# Altium project SX1308_GTW_e381v02c.PrjPCB
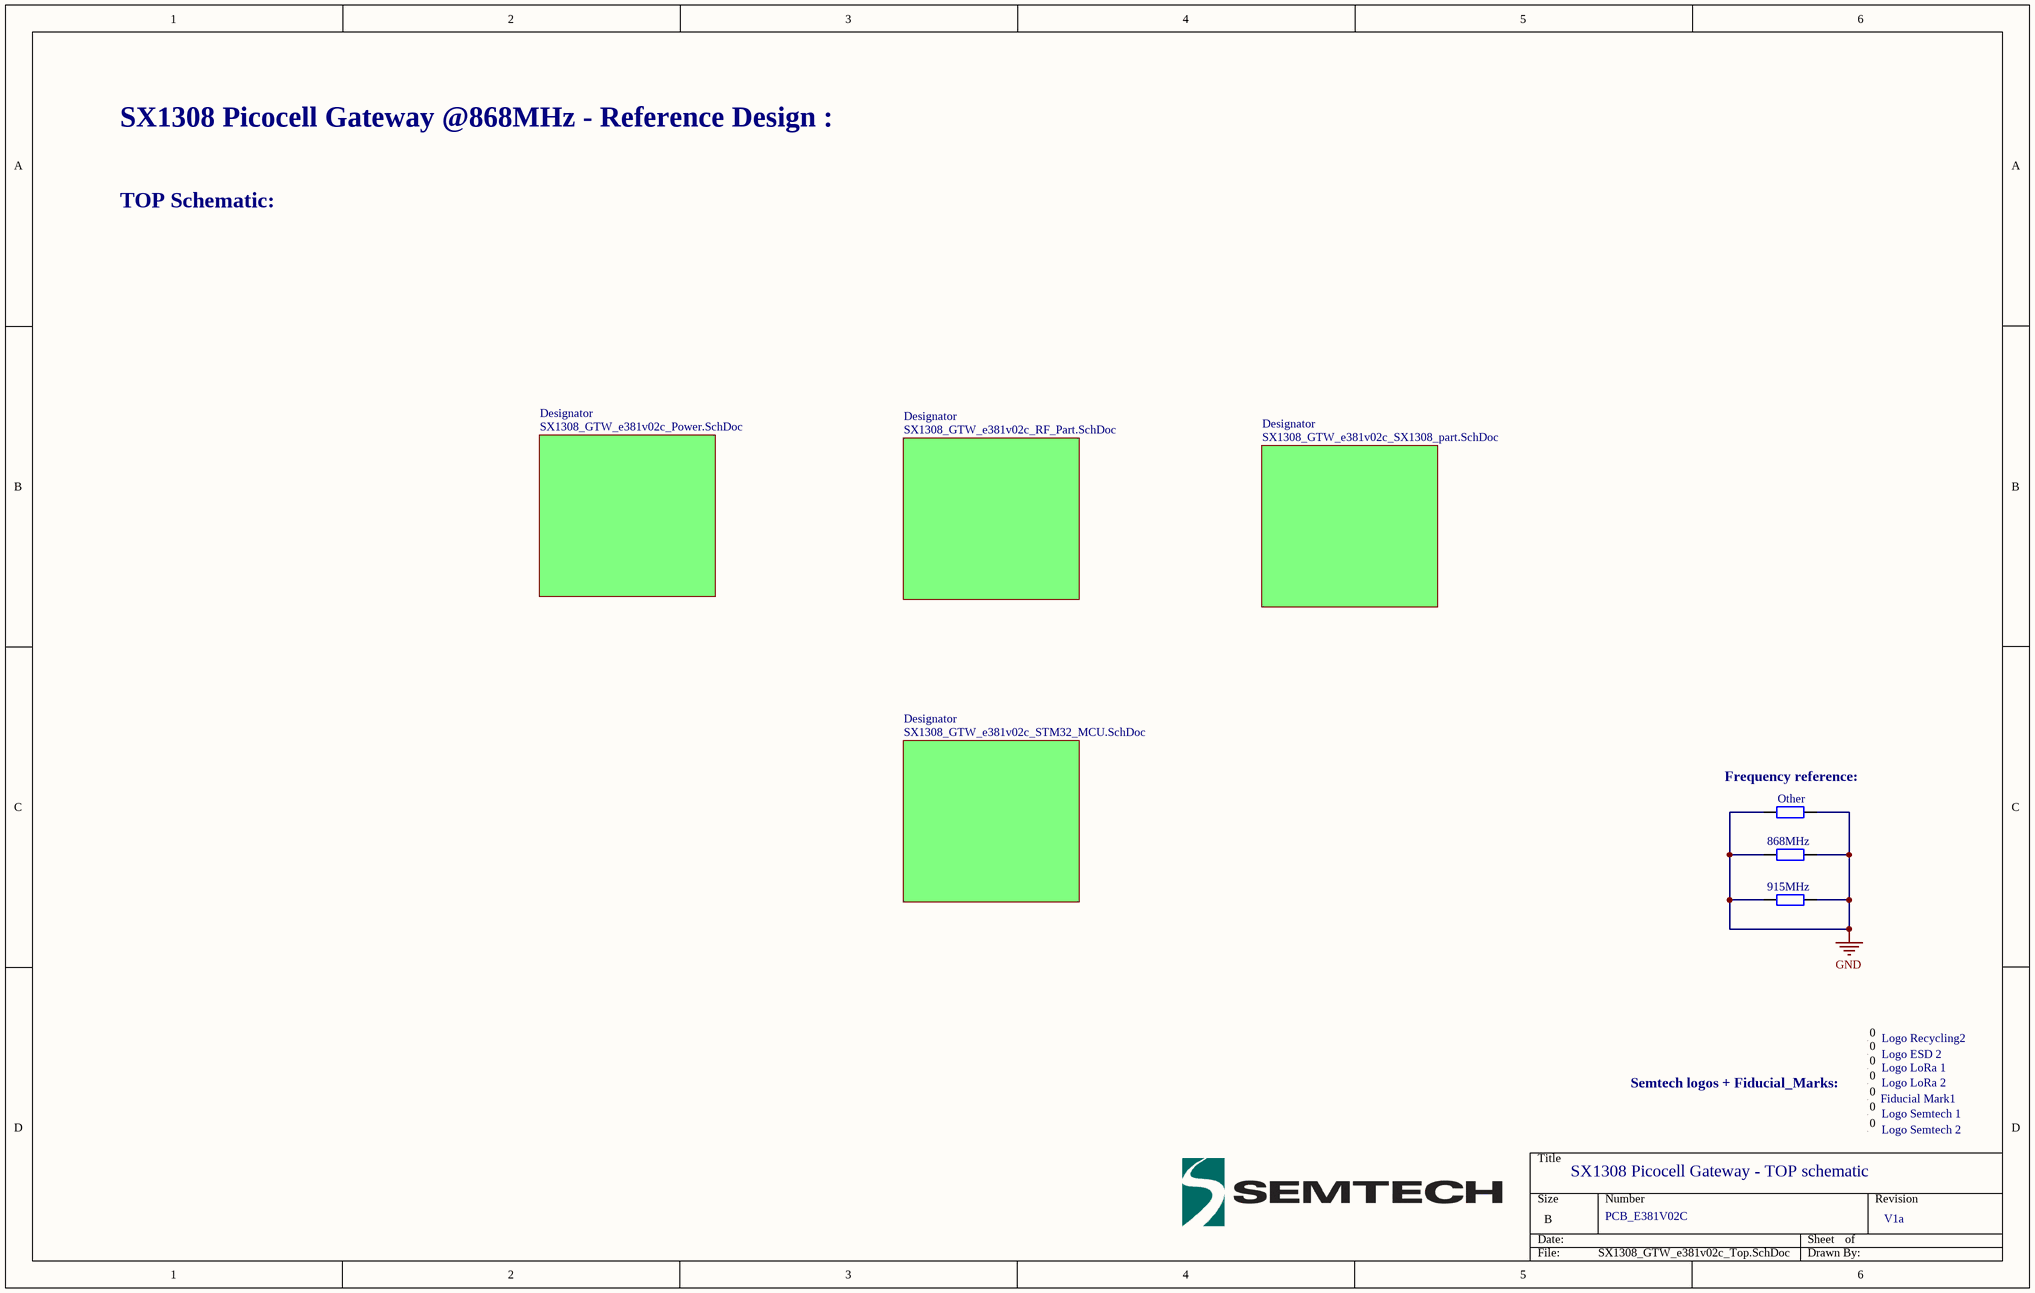
[diagram p0: SX1308_GTW_e381v02c_Top.SchDoc]
5 sheets, 180 parts. Net scope: global (net labels, ports and power ports of the same name join across sheets).
Board file: SX1308_GTW_e381v02c.PcbDoc
Sheets:
  SX1308_GTW_e381v02c_Top.SchDoc
    Designator = SX1308_GTW_e381v02c_Power.SchDoc
    Designator = SX1308_GTW_e381v02c_SX1308_part.SchDoc
    Designator = SX1308_GTW_e381v02c_RF_Part.SchDoc
    Designator = SX1308_GTW_e381v02c_STM32_MCU.SchDoc

## Sheet SX1308_GTW_e381v02c_Top.SchDoc
size B; DocumentNumber: 5; SheetNumber: 5; SheetTotal: 5

### Parts
868MHz  Resistor  [rlc_402_smd]  (value not drawn)
915MHz  Resistor  [rlc_402_smd]  (value not drawn)
Fiducial_Mark1  Logo symbol  BOT  [fiducial_mark_signal_top]  (value not drawn)
Logo_ESD_2  Logo symbol  [Logo ESD]  (value not drawn)
Logo_LoRa_1  Logo symbol TOP  [Logo LoRa Size3]  (value not drawn)
Logo_LoRa_2  Logo symbol TOP  [Logo LoRa Size3]  (value not drawn)
Logo_Recycling2  Logo symbol  [Logo Recycling1]  (value not drawn)
Logo_Semtech_1  Logo symbol TOP  [logo_semtech_horiz_size3]  (value not drawn)
Logo_Semtech_2  Logo Semtech  Bot2  [logo_semtech_horiz_size2]  (value not drawn)
Other  Resistor  [rlc_402_smd]  (value not drawn)

### Sub-sheets
Designator = SX1308_GTW_e381v02c_Power.SchDoc: no entries
Designator = SX1308_GTW_e381v02c_SX1308_part.SchDoc: no entries
Designator = SX1308_GTW_e381v02c_RF_Part.SchDoc: no entries
Designator = SX1308_GTW_e381v02c_STM32_MCU.SchDoc: no entries

### Nets
GND: 868MHz.1 868MHz.2 915MHz.1 915MHz.2 Other.1 Other.2

Not connected (* = marked no-connect by the designer): Fiducial_Mark1 0; Logo_ESD_2 0; Logo_LoRa_1 0; Logo_LoRa_2 0; Logo_Recycling2 0; Logo_Semtech_1 0; Logo_Semtech_2 0

### Notes on the sheet
- SX1308 Picocell Gateway @868MHz - Reference Design :
- TOP Schematic:
- (near Other) Frequency reference:
- Semtech logos + Fiducial_Marks:
- SX1308 Picocell Gateway - TOP schematic
- PCB_E381V02C
- V1a

### Library data of the parts
868MHz 915MHz Other = Resistor: Resistor SMD - IEC symbol version; LatestRevisionDate: 27-Jul-20  -  Semtech; Value: ?
Fiducial_Mark1 Logo_ESD_2 Logo_LoRa_1 Logo_LoRa_2 Logo_Recycling2 Logo_Semtech_1 Logo_Semtech_2 = Logo: Schematic symbol for Logo

## Sheet SX1308_GTW_e381v02c_Power.SchDoc
size B; DrawnBy: Erik Fountain; DocumentNumber: 4; SheetNumber: 4; SheetTotal: 5; PageSetup: Record=PageOptions|CenterHorizontal=True|CenterVertical=True|PrintScale=0.72|XCorrection=1.00|YCorrection=1.00|PrintKind=0|BorderSize=5000000|LeftOffset=0|BottomOffset=0|Orientation=2|PaperLength=1000|PaperWidth=1000|Scale=100|PaperSource=7|PrintQuality=-4|MediaType=1|DitherType=10|PaperKind=Letter|PrintScaleMode=1
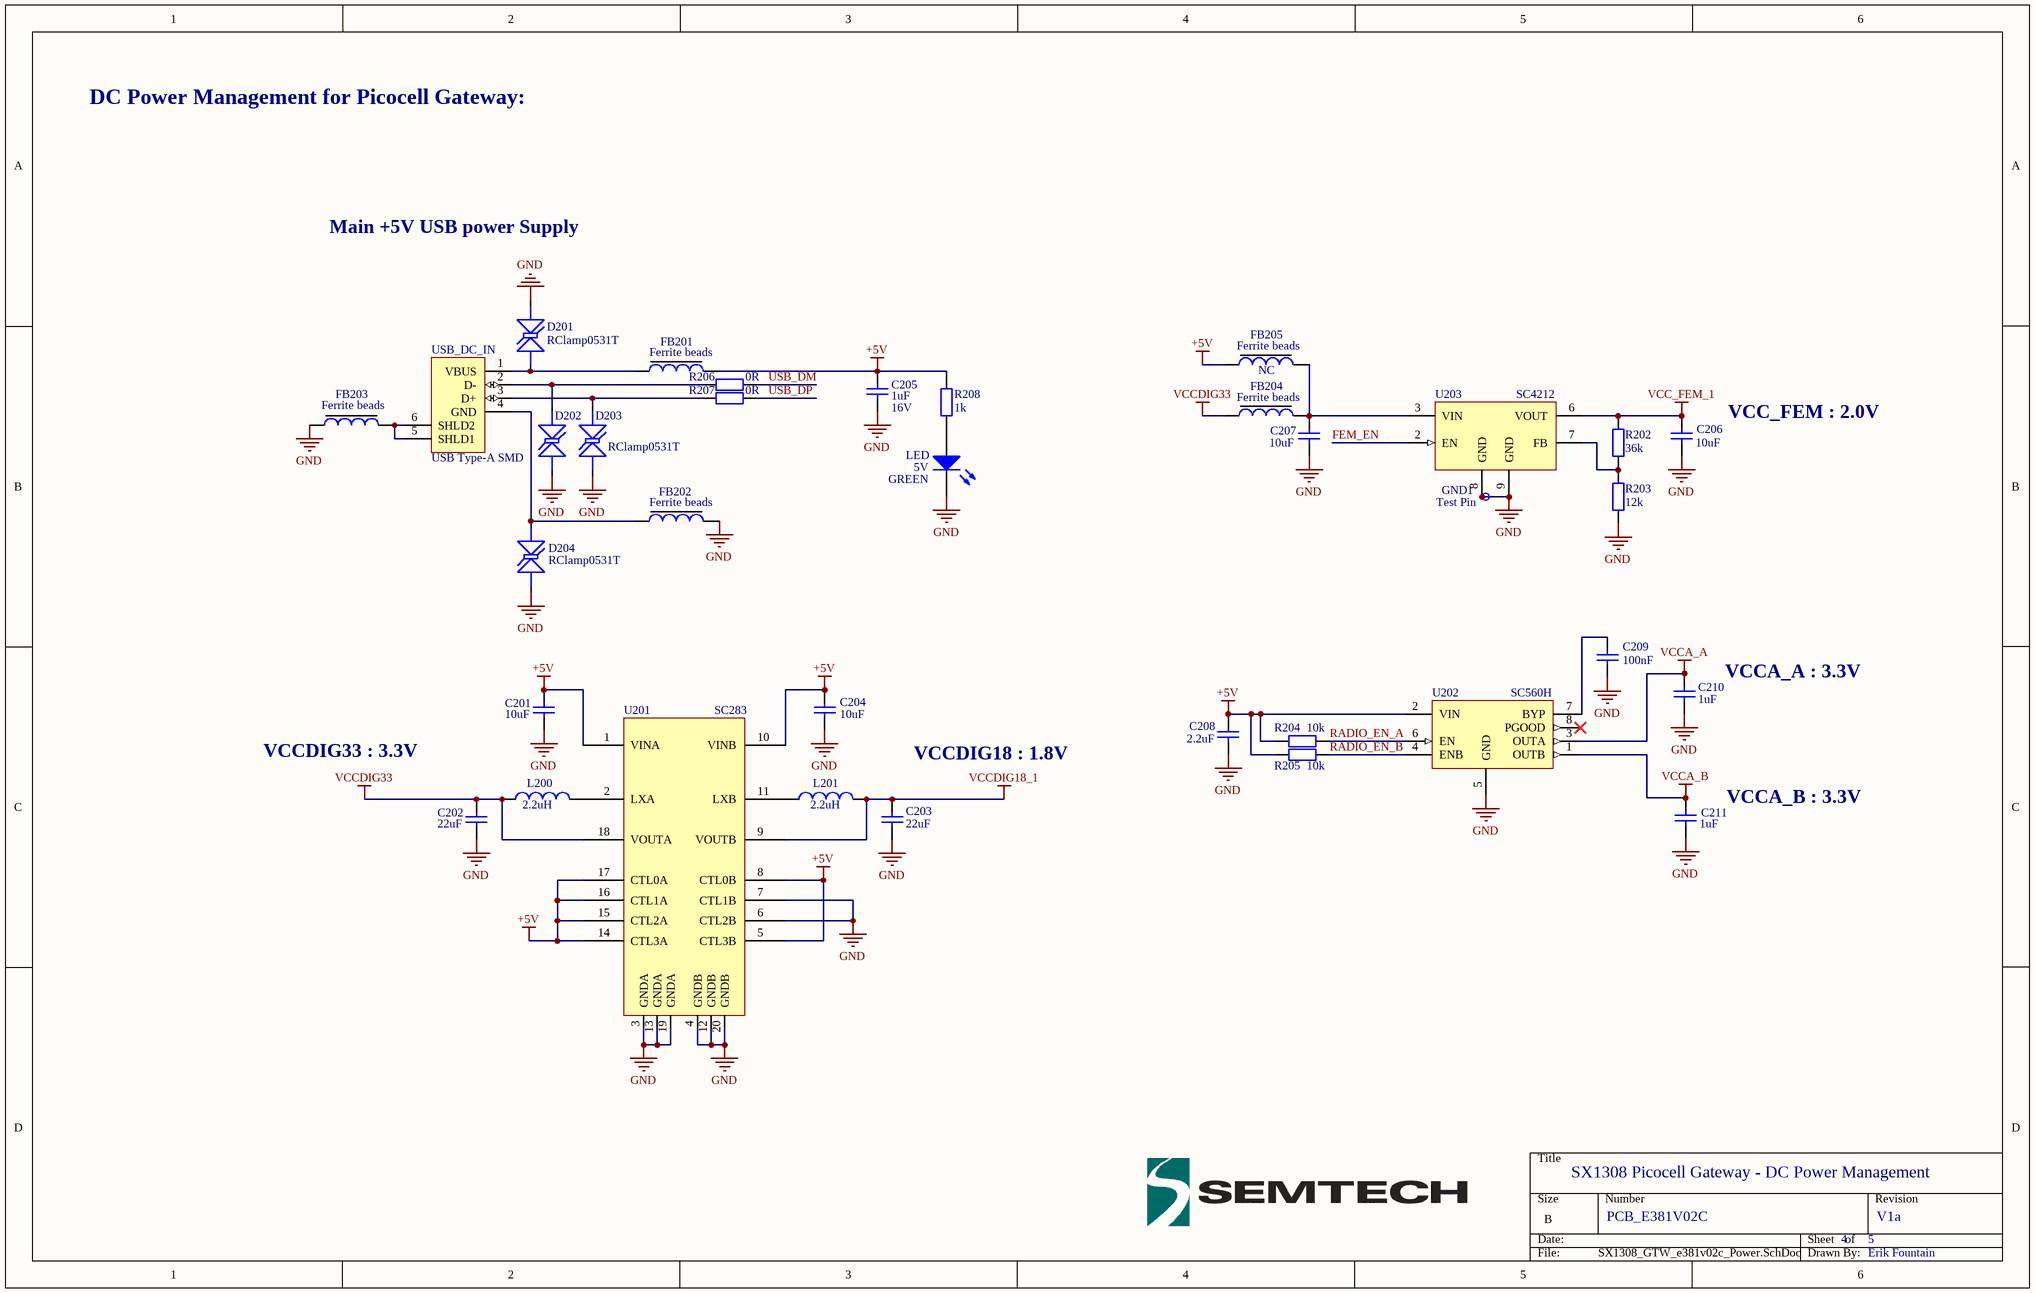
[diagram p1: SX1308_GTW_e381v02c_Power.SchDoc]

### Parts
5V  LED  Type: GREEN  [CD1608-0603]
C201  value 10uF  [C1206]  (hidden comment: Cap)
C202  value 22uF  [C1206]  (hidden comment: Cap)
C203  value 22uF  [C1206]  (hidden comment: Cap)
C204  value 10uF  [C1206]  (hidden comment: Cap)
C205  value 1uF  DC Voltage: 16V  [rlc_805_smd]  (hidden comment: Cap)
C206  value 10uF  [rlc_805_smd]  (hidden comment: Cap)
C207  value 10uF  [rlc_805_smd]  (hidden comment: Cap)
C208  value 2.2uF  [rlc_603_smd]  (hidden comment: Cap)
C209  value 100nF  [rlc_402_smd]  (hidden comment: Cap)
C210  value 1uF  [rlc_805_smd]  (hidden comment: Cap)
C211  value 1uF  [rlc_805_smd]  (hidden comment: Cap)
D201  RClamp0531T  [SLP1006P2T]
D202  RClamp0531T  [SLP1006P2T]  (value not drawn)
D203  RClamp0531T  [SLP1006P2T]
D204  RClamp0531T  [SLP1006P2T]
FB201  Ferrite beads  [rlc_402_smd]
FB202  Ferrite beads  [rlc_402_smd]
FB203  Ferrite beads  [rlc_402_smd]
FB204  Ferrite beads  [rlc_402_smd]
FB205  Ferrite beads  value NC  [rlc_402_smd]
GND1  Test Pin  [pin_1mm]
L200  value 2.2uH  [L4818]  (hidden comment: Inductor)
L201  value 2.2uH  [L4818]  (hidden comment: Inductor)
R202  value 36k  [rlc_402_smd]  (hidden comment: Resistor)
R203  value 12k  [rlc_402_smd]  (hidden comment: Resistor)
R204  value 10k  [rlc_402_smd]  (hidden comment: Resistor)
R205  value 10k  [rlc_402_smd]  (hidden comment: Resistor)
R206  value 0R  [rlc_402_smd]  (hidden comment: Resistor)
R207  value 0R  [rlc_402_smd]  (hidden comment: Resistor)
R208  value 1k  [rlc_402_smd]  (hidden comment: Resistor)
U201  SC283  [MLPQ-W18]
U202  SC560H  [MLPQ-UT8]
U203  SC4212  [MLPD-8 3x3mm]
USB_DC_IN  USB Type-A SMD  [Keystone USB Type 931]

### Nets
+5V: C201.1 C204.1 C205.1 C208.1 FB201.2 FB205.1 R204.1 R205.1 R208.1 U201.1(VINA) U201.5(CTL3B) U201.8(CTL0B) U201.10(VINB) U201.14(CTL3A) U201.15(CTL2A) U201.16(CTL1A) U201.17(CTL0A) U202.2(VIN)
GND: 5V.2(K) C201.2 C202.2 C203.2 C204.2 C205.2 C206.2 C207.2 C208.2 C209.1 C210.2 C211.2 D201.2(K) D202.2(K) D203.2(K) D204.2(K) FB202.2 FB203.1 GND1.1(pin) R203.2 U201.3(GNDA) U201.4(GNDB) U201.6(CTL2B) U201.7(CTL1B) U201.12(GNDB) U201.13(GNDA) U201.19(GNDA) U201.20(GNDB) U202.5(GND) U203.8(GND) U203.9(GND)
VCC_FEM_1: C206.1 R202.1 U203.6(VOUT)
VCCA_A: C210.1 U202.3(OUTA)
VCCA_B: C211.1 U202.1(OUTB)
VCCDIG18_1: C203.1 L201.2 U201.9(VOUTB)
VCCDIG33: C202.1 FB204.1 L200.1 U201.18(VOUTA)
FEM_EN: U203.2(EN)
RADIO_EN_A: R204.2 U202.6(EN)
RADIO_EN_B: R205.2 U202.4(ENB)
USB_DM: R206.2
USB_DP: R207.2
Net5V_1: 5V.1(A) R208.2
NetC207_1: C207.1 FB204.2 FB205.2 U203.3(VIN)
NetC209_2: C209.2 U202.7(BYP)
NetD201_1: D201.1(A) FB201.1 USB_DC_IN.1(VBUS)
NetD202_1: D202.1(A) R206.1 USB_DC_IN.2(D-)
NetD203_1: D203.1(A) R207.1 USB_DC_IN.3(D+)
NetD204_1: D204.1(A) FB202.1 USB_DC_IN.4(GND)
NetFB203_2: FB203.2 USB_DC_IN.5(SHLD1) USB_DC_IN.6(SHLD2)
NetL200_2: L200.2 U201.2(LXA)
NetL201_1: L201.1 U201.11(LXB)
NetR202_2: R202.2 R203.1 U203.7(FB)

Not connected (* = marked no-connect by the designer): U202 8(PGOOD)*

### Notes on the sheet
- DC Power Management for Picocell Gateway:
- Main +5V USB power Supply
- (near C206) VCC_FEM : 2.0V
- (near C210) VCCA_A : 3.3V
- VCCDIG33 : 3.3V
- VCCDIG18 : 1.8V
- (near C211) VCCA_B : 3.3V
- SX1308 Picocell Gateway - DC Power Management
- PCB_E381V02C
- V1a

### Library data of the parts
C201-C211 = Cap: Capacitor SMD; Published: 8-Jun-2000; LatestRevisionDate: 05-oct-2007  -  Semtech; LatestRevisionNote: Re-released for DXP Platform.; Publisher: Altium Limited
D201-D204 = RClamp0531T: Ultra Low Capacitance 1-line ESD Protection; LatestRevisionDate: 23-Aug-2016; Type: RClamp0531T
FB201 FB202 FB204 = Ferrite beads: Value: VAL?
GND1 = test_pin: LatestRevisionDate: 05-oct-2007  -  Semtech
L200 L201 = Inductor: Code_IEC: 1005; Published: 8-Jun-2000; LatestRevisionDate: 05-oct-2007  -  Semtech; LatestRevisionNote: Re-released for DXP Platform.; Publisher: Altium Limited; Code_JEITA: 0402
R202-R208 = Resistor: Resistor SMD - IEC symbol version; LatestRevisionDate: 27-Jul-20  -  Semtech
U201 = SC283: SC283 - Dual Channel 2.5MHz, 1.8A  Synchronous Step-Down Regulator
U202 = SC560H: SC560H - Dual Output Low Noise LDO  Linear Regulator
U203 = SC4212: SC4212 - Very Low Input /Very Low Dropout  1Amp Regulator With Enable; Value: ?
USB_DC_IN = USB Type-A SMD: USB 2.0 SMT, Type A, Receptacle, 4 Position
5V = LED: LatestRevisionDate: 05-oct-2007  -  Semtech

## Sheet SX1308_GTW_e381v02c_SX1308_part.SchDoc: SX1280_Demo_RF
size B; DrawnBy: Erik Fountain; DocumentNumber: 1; SheetNumber: 1; SheetTotal: 5; PageSetup: Record=PageOptions|CenterHorizontal=True|CenterVertical=True|PrintScale=0.72|XCorrection=1.00|YCorrection=1.00|PrintKind=0|BorderSize=5000000|LeftOffset=0|BottomOffset=0|Orientation=2|PaperLength=1000|PaperWidth=1000|Scale=100|PaperSource=7|PrintQuality=-4|MediaType=1|DitherType=10|PaperKind=Letter|PrintScaleMode=1; DocumentName: SX1280_Demo_RF
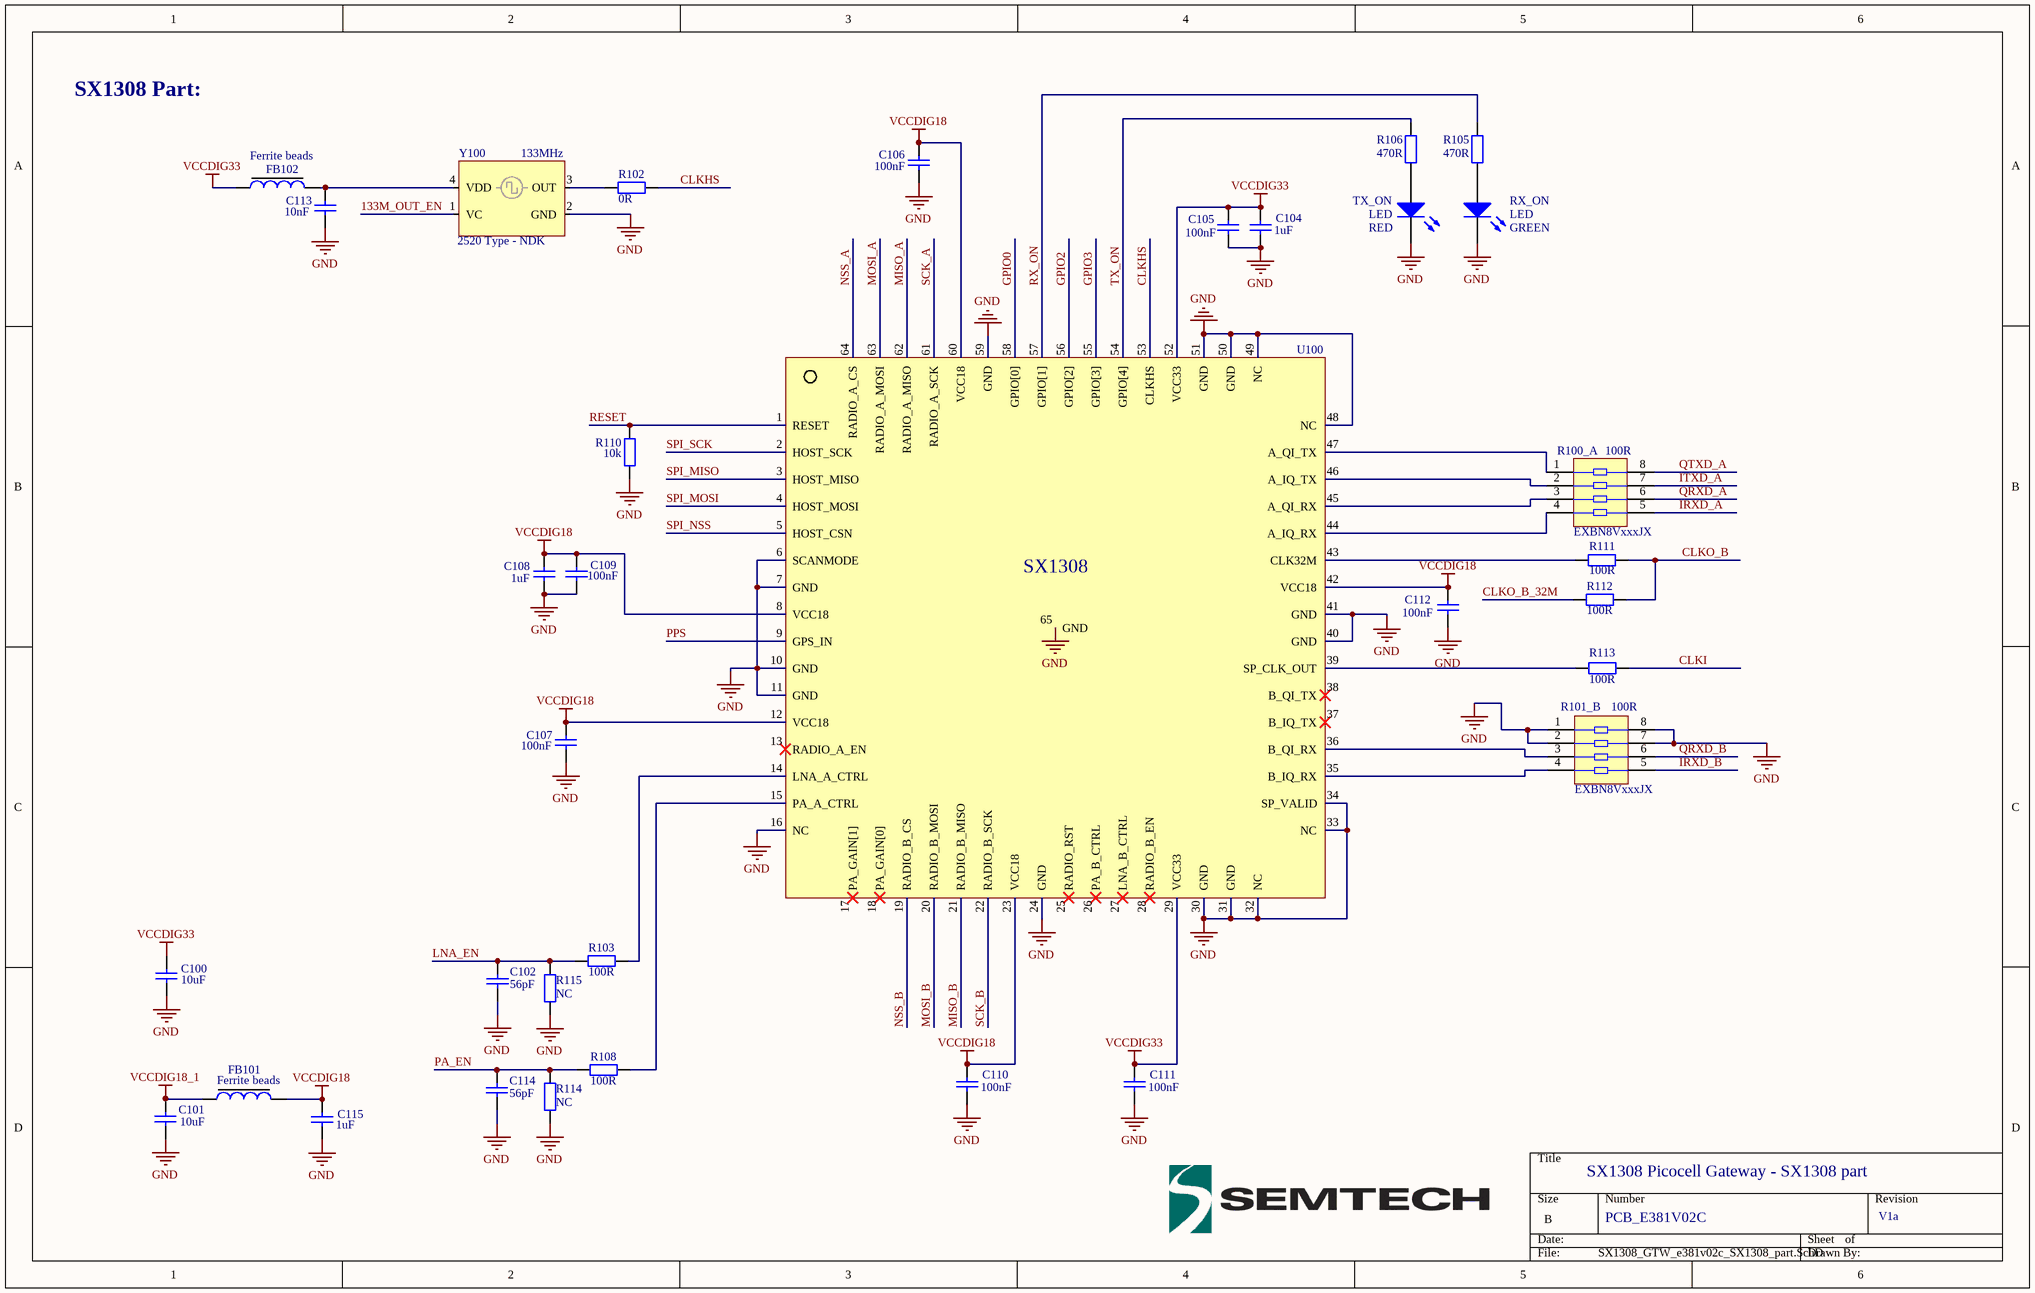
[diagram p2: SX1308_GTW_e381v02c_SX1308_part.SchDoc]

### Parts
C100  value 10uF  [rlc_805_smd]  (hidden comment: Cap)
C101  value 10uF  [rlc_805_smd]  (hidden comment: Cap)
C102  value 56pF  [rlc_402_smd]  (hidden comment: Cap)
C104  value 1uF  [rlc_603_smd]  (hidden comment: Cap)
C105  value 100nF  [rlc_402_smd]  (hidden comment: Cap)
C106  value 100nF  [rlc_402_smd]  (hidden comment: Cap)
C107  value 100nF  [rlc_402_smd]  (hidden comment: Cap)
C108  value 1uF  [rlc_603_smd]  (hidden comment: Cap)
C109  value 100nF  [rlc_402_smd]  (hidden comment: Cap)
C110  value 100nF  [rlc_402_smd]  (hidden comment: Cap)
C111  value 100nF  [rlc_402_smd]  (hidden comment: Cap)
C112  value 100nF  [rlc_402_smd]  (hidden comment: Cap)
C113  value 10nF  [rlc_402_smd]  (hidden comment: Cap)
C114  value 56pF  [rlc_402_smd]  (hidden comment: Cap)
C115  value 1uF  [rlc_603_smd]  (hidden comment: Cap)
FB101  Ferrite beads  [rlc_402_smd]
FB102  Ferrite beads  [rlc_402_smd]
R100_A  EXBN8VxxxJX  value 100R  [EXB28V]
R101_B  EXBN8VxxxJX  value 100R  [EXB28V]
R102  value 0R  [rlc_402_smd]  (hidden comment: Resistor)
R103  value 100R  [rlc_402_smd]  (hidden comment: Resistor)
R105  value 470R  [rlc_402_smd]  (hidden comment: Resistor)
R106  value 470R  [rlc_402_smd]  (hidden comment: Resistor)
R108  value 100R  [rlc_402_smd]  (hidden comment: Resistor)
R110  value 10k  [rlc_402_smd]  (hidden comment: Resistor)
R111  value 100R  [rlc_402_smd]  (hidden comment: Resistor)
R112  value 100R  [rlc_402_smd]  (hidden comment: Resistor)
R113  value 100R  [rlc_402_smd]  (hidden comment: Resistor)
R114  value NC  [rlc_402_smd]  (hidden comment: Resistor)
R115  value NC  [rlc_402_smd]  (hidden comment: Resistor)
RX_ON  LED  Type: GREEN  [CD3224]
TX_ON  LED  Type: RED  [CD3224]
U100  SX1308  [vqfn64_9x9mm]
Y100  2520 Type - NDK  value 133MHz  [TCXO 2.5x2.0mm]

### Nets
GND: C100.1 C101.1 C102.1 C104.1 C105.1 C106.1 C107.1 C108.1 C109.1 C110.1 C111.1 C112.1 C113.1 C114.1 C115.2 R101_B.1 R101_B.2 R101_B.7 R101_B.8 R110.1 R114.2 R115.2 RX_ON.2(K) TX_ON.2(K) U100.6(SCANMODE) U100.7(GND) U100.10(GND) U100.11(GND) U100.16(NC) U100.24(GND) U100.30(GND) U100.31(GND) U100.32(NC) U100.33(NC) U100.34(SP_VALID) U100.40(GND) U100.41(GND) U100.48(NC) U100.49(NC) U100.50(GND) U100.51(GND) U100.59(GND) U100.65(GND) Y100.2(GND)
VCCDIG18: C106.2 C107.2 C108.2 C109.2 C110.2 C112.2 C115.1 FB101.2 U100.8(VCC18) U100.12(VCC18) U100.23(VCC18) U100.42(VCC18) U100.60(VCC18)
VCCDIG18_1: C101.2 FB101.1
VCCDIG33: C100.2 C104.2 C105.2 C111.2 FB102.1 U100.29(VCC33) U100.52(VCC33)
133M_OUT_EN: Y100.1(VC)
CLKHS: R102.1 U100.53(CLKHS)
CLKI: R113.2
CLKO_B: R111.2 R112.2
CLKO_B_32M: R112.1
GPIO0: U100.58(GPIO[0])
GPIO2: U100.56(GPIO[2])
GPIO3: U100.55(GPIO[3])
IRXD_A: R100_A.5
IRXD_B: R101_B.5
ITXD_A: R100_A.7
LNA_EN: C102.2 R103.2 R115.1
MISO_A: U100.62(RADIO_A_MISO)
MISO_B: U100.21(RADIO_B_MISO)
MOSI_A: U100.63(RADIO_A_MOSI)
MOSI_B: U100.20(RADIO_B_MOSI)
NSS_A: U100.64(RADIO_A_CS)
NSS_B: U100.19(RADIO_B_CS)
PA_EN: C114.2 R108.2 R114.1
PPS: U100.9(GPS_IN)
QRXD_A: R100_A.6
QRXD_B: R101_B.6
QTXD_A: R100_A.8
RESET: R110.2 U100.1(RESET)
RX_ON: R105.2 U100.57(GPIO[1])
SCK_A: U100.61(RADIO_A_SCK)
SCK_B: U100.22(RADIO_B_SCK)
SPI_MISO: U100.3(HOST_MISO)
SPI_MOSI: U100.4(HOST_MOSI)
SPI_NSS: U100.5(HOST_CSN)
SPI_SCK: U100.2(HOST_SCK)
TX_ON: R106.2 U100.54(GPIO[4])
NetC113_2: C113.2 FB102.2 Y100.4(VDD)
NetR100_A_1: R100_A.1 U100.47(A_QI_TX)
NetR100_A_2: R100_A.2 U100.46(A_IQ_TX)
NetR100_A_3: R100_A.3 U100.45(A_QI_RX)
NetR100_A_4: R100_A.4 U100.44(A_IQ_RX)
NetR101_B_3: R101_B.3 U100.36(B_QI_RX)
NetR101_B_4: R101_B.4 U100.35(B_IQ_RX)
NetR102_2: R102.2 Y100.3(OUT)
NetR103_1: R103.1 U100.14(LNA_A_CTRL)
NetR105_1: R105.1 RX_ON.1(A)
NetR106_1: R106.1 TX_ON.1(A)
NetR108_1: R108.1 U100.15(PA_A_CTRL)
NetR111_1: R111.1 U100.43(CLK32M)
NetR113_1: R113.1 U100.39(SP_CLK_OUT)

Not connected (* = marked no-connect by the designer): U100 13(RADIO_A_EN)* 17(PA_GAIN[1])* 18(PA_GAIN[0])* 25(RADIO_RST)* 26(PA_B_CTRL)* 27(LNA_B_CTRL)* 28(RADIO_B_EN)* 37(B_IQ_TX)* 38(B_QI_TX)*

### Notes on the sheet
- SX1308 Part:
- SX1308 Picocell Gateway - SX1308 part
- PCB_E381V02C
- V1a

### Library data of the parts
C100-C102 C104-C115 = Cap: Capacitor SMD; Published: 8-Jun-2000; LatestRevisionDate: 05-oct-2007  -  Semtech; LatestRevisionNote: Re-released for DXP Platform.; Publisher: Altium Limited
FB101 FB102 = Ferrite beads: Value: VAL?
R100_A R101_B = EXBN8VxxxJX: Mini-Flat Package, Isolated Resistor Network, 0.031 W/resistor
R102 R103 R105 R106 R108 R110-R115 = Resistor: Resistor SMD - IEC symbol version; LatestRevisionDate: 27-Jul-20  -  Semtech
U100 = SX1301: SX1301 - Base Band Processor for Data Concentrator for Long Range Communication Network; Apps Pinout; LatestRevisionDate: 06-Dec-2013
Y100 = VCTCXO
RX_ON TX_ON = LED: LatestRevisionDate: 05-oct-2007  -  Semtech

## Sheet SX1308_GTW_e381v02c_RF_Part.SchDoc: SX1280_Demo_RF
size A2; DrawnBy: Erik Fountain; DocumentNumber: 2; SheetNumber: 2; SheetTotal: 5; PageSetup: Record=PageOptions|CenterHorizontal=True|CenterVertical=True|PrintScale=0.47|XCorrection=1.00|YCorrection=1.00|PrintKind=0|BorderSize=5000000|LeftOffset=0|BottomOffset=0|Orientation=2|PaperLength=1000|PaperWidth=1000|Scale=100|PaperSource=7|PrintQuality=-4|MediaType=1|DitherType=10|PaperKind=Letter|PrintScaleMode=1; DocumentName: SX1280_Demo_RF
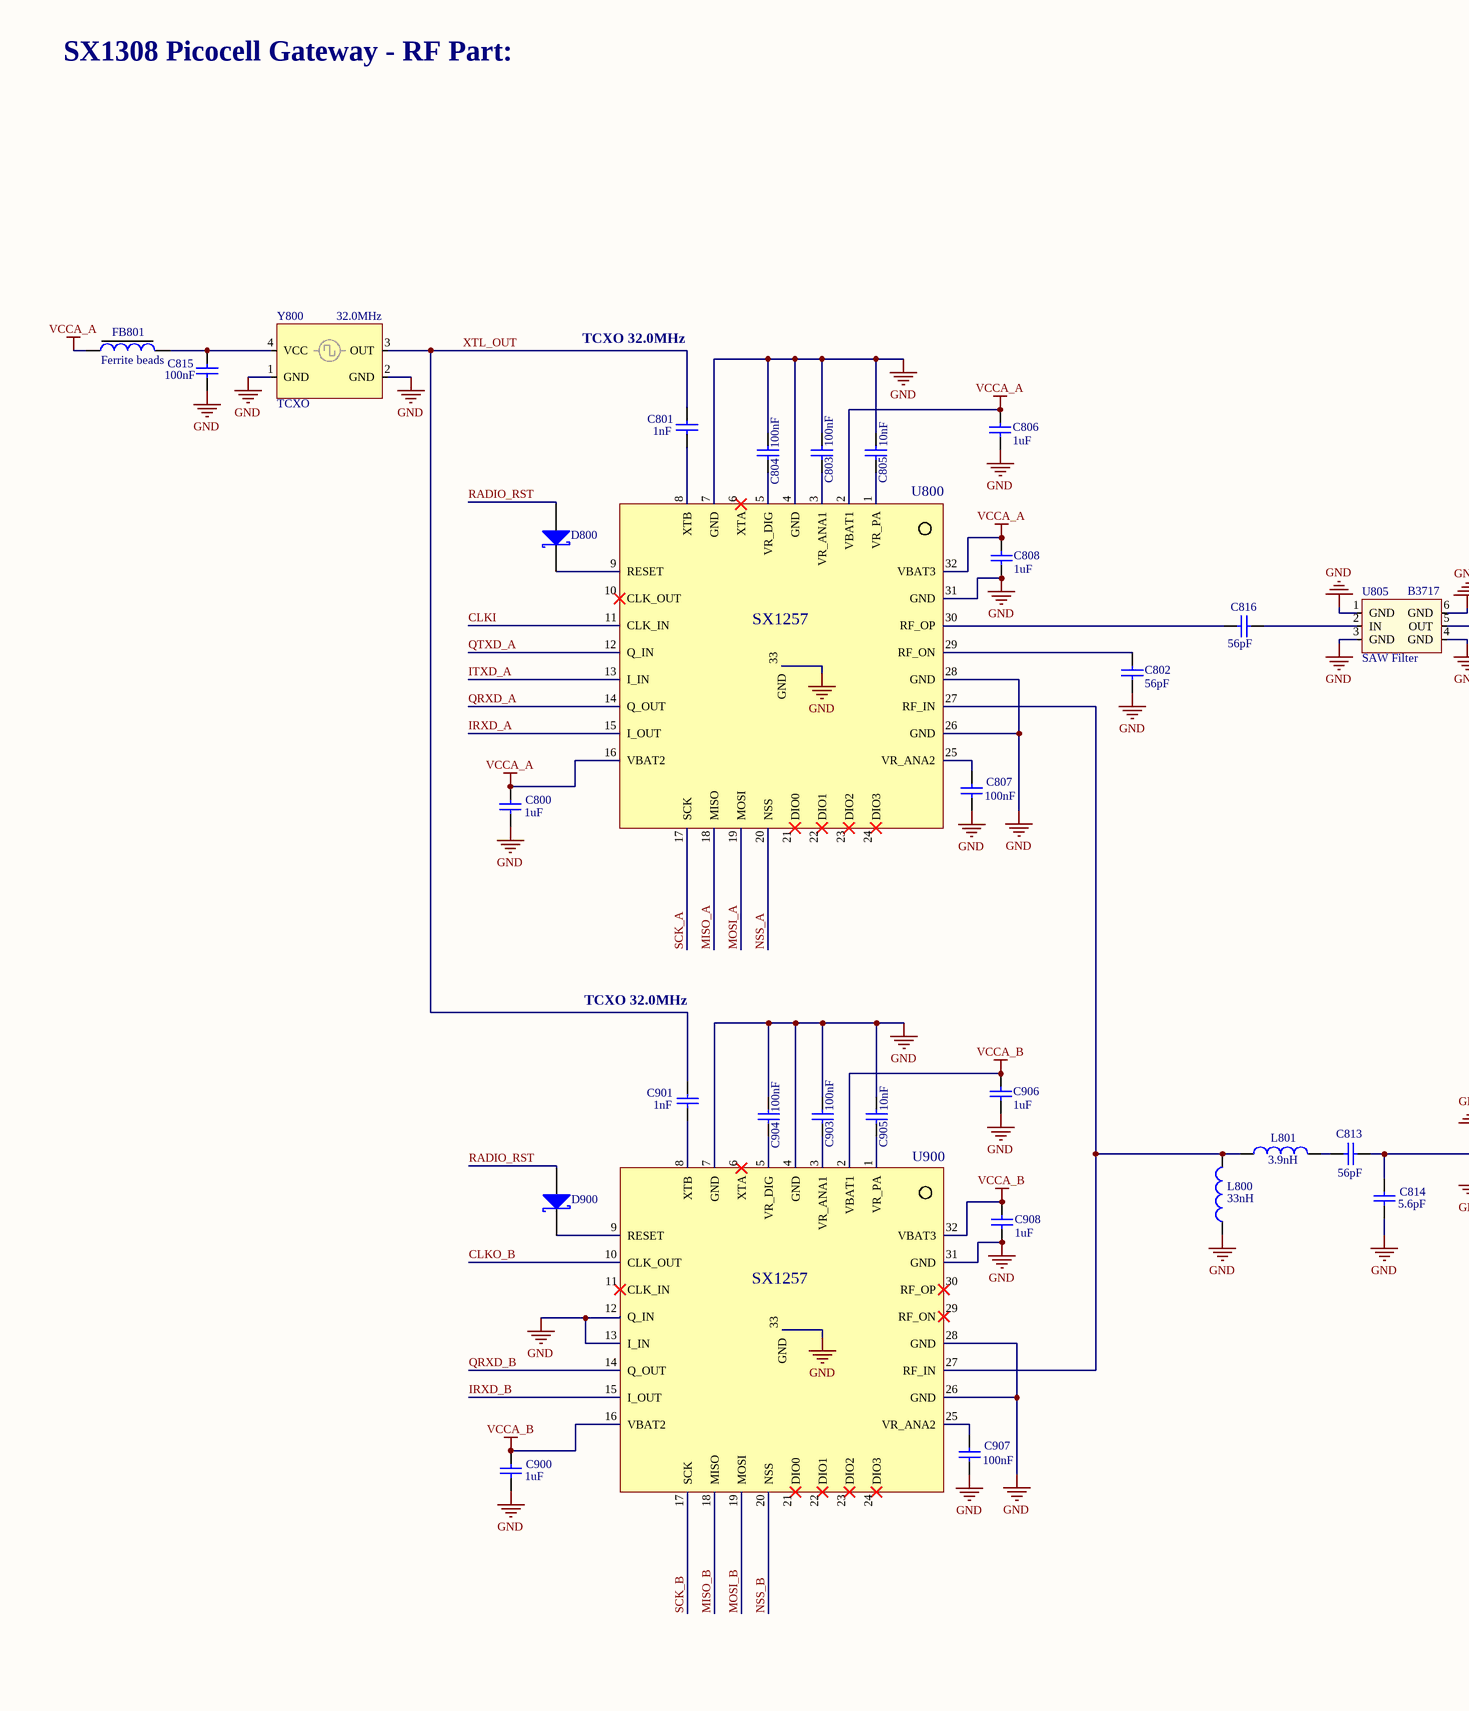
[diagram p3: SX1308_GTW_e381v02c_RF_Part.SchDoc, left]
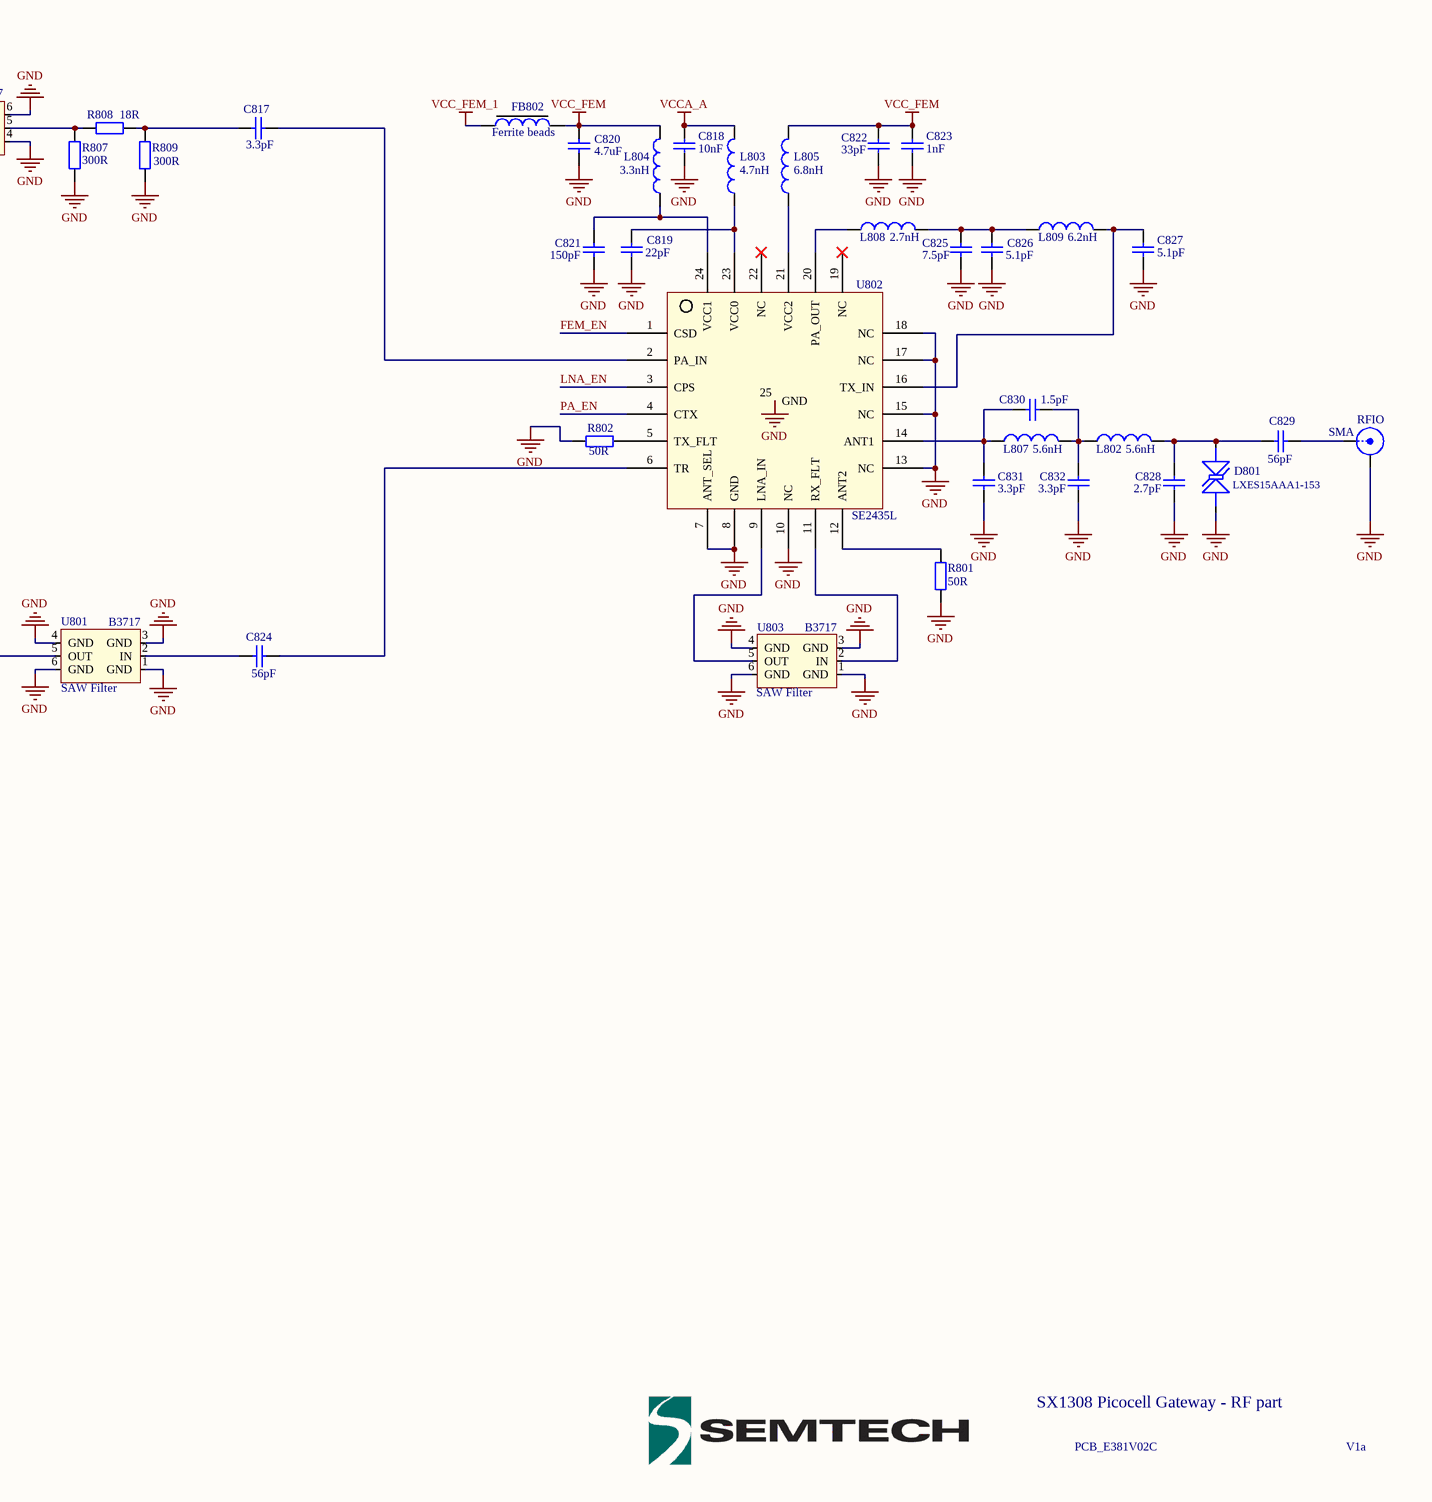
[diagram p4: SX1308_GTW_e381v02c_RF_Part.SchDoc, right]

### Parts
C800  value 1uF  [rlc_603_smd]  (hidden comment: Cap)
C801  value 1nF  [rlc_402_smd]  (hidden comment: Cap)
C802  value 56pF  [rlc_402_smd]  (hidden comment: Cap)
C803  value 100nF  [rlc_402_smd]  (hidden comment: Cap)
C804  value 100nF  [rlc_402_smd]  (hidden comment: Cap)
C805  value 10nF  [rlc_402_smd]  (hidden comment: Cap)
C806  value 1uF  [rlc_603_smd]  (hidden comment: Cap)
C807  value 100nF  [rlc_402_smd]  (hidden comment: Cap)
C808  value 1uF  [rlc_603_smd]  (hidden comment: Cap)
C813  value 56pF  [rlc_402_smd]  (hidden comment: Cap)
C814  value 5.6pF  [rlc_402_smd]  (hidden comment: Cap)
C815  value 100nF  [rlc_402_smd]  (hidden comment: Cap)
C816  value 56pF  [rlc_402_smd]  (hidden comment: Cap)
C817  value 3.3pF  [rlc_402_smd]  (hidden comment: Cap)
C818  value 10nF  [rlc_402_smd]  (hidden comment: Cap)
C819  value 22pF  [rlc_402_smd]  (hidden comment: Cap)
C820  value 4.7uF  [rlc_603_smd]  (hidden comment: Cap)
C821  value 150pF  [rlc_402_smd]  (hidden comment: Cap)
C822  value 33pF  [rlc_402_smd]  (hidden comment: Cap)
C823  value 1nF  [rlc_402_smd]  (hidden comment: Cap)
C824  value 56pF  [rlc_402_smd]  (hidden comment: Cap)
C825  value 7.5pF  [rlc_402_smd]  (hidden comment: Cap)
C826  value 5.1pF  [rlc_402_smd]  (hidden comment: Cap)
C827  value 5.1pF  [rlc_402_smd]  (hidden comment: Cap)
C828  value 2.7pF  [rlc_402_smd]  (hidden comment: Cap)
C829  value 56pF  [rlc_402_smd]  (hidden comment: Cap)
C830  value 1.5pF  [rlc_402_smd]  (hidden comment: Cap)
C831  value 3.3pF  [rlc_402_smd]  (hidden comment: Cap)
C832  value 3.3pF  [rlc_402_smd]  (hidden comment: Cap)
C900  value 1uF  [rlc_603_smd]  (hidden comment: Cap)
C901  value 1nF  [rlc_402_smd]  (hidden comment: Cap)
C903  value 100nF  [rlc_402_smd]  (hidden comment: Cap)
C904  value 100nF  [rlc_402_smd]  (hidden comment: Cap)
C905  value 10nF  [rlc_402_smd]  (hidden comment: Cap)
C906  value 1uF  [rlc_603_smd]  (hidden comment: Cap)
C907  value 100nF  [rlc_402_smd]  (hidden comment: Cap)
C908  value 1uF  [rlc_603_smd]  (hidden comment: Cap)
D800  D Schottky  [SOD523]  (value not drawn)
D801  Type: LXES15AAA1-153  [SLP1006P2T]  (hidden comment: RClamp0531T)
D900  D Schottky  [SOD523]  (value not drawn)
FB801  Ferrite beads  [rlc_402_smd]
FB802  Ferrite beads  [rlc_603_smd]
L800  value 33nH  [rlc_402_smd]  (hidden comment: Inductor)
L801  value 3.9nH  [rlc_402_smd]  (hidden comment: Inductor)
L802  value 5.6nH  [rlc_402_smd]  (hidden comment: Inductor)
L803  value 4.7nH  [rlc_402_smd]  (hidden comment: Inductor)
L804  value 3.3nH  [rlc_402_smd]  (hidden comment: Inductor)
L805  value 6.8nH  [rlc_402_smd]  (hidden comment: Inductor)
L807  value 5.6nH  [rlc_402_smd]  (hidden comment: Inductor)
L808  value 2.7nH  [rlc_402_smd]  (hidden comment: Inductor)
L809  value 6.2nH  [rlc_402_smd]  (hidden comment: Inductor)
R801  value 50R  [rlc_402_smd]  (hidden comment: Resistor)
R802  value 50R  [rlc_402_smd]  (hidden comment: Resistor)
R807  value 300R  [rlc_402_smd]  (hidden comment: Resistor)
R808  value 18R  [rlc_402_smd]  (hidden comment: Resistor)
R809  value 300R  [rlc_402_smd]  (hidden comment: Resistor)
RFIO  SMA  [SMA_end_launch_1.6mm_6.35mm]
U800  SX1257  [vqfn32_5x5mm]
U801  SAW Filter  value B3717  [DCC6C_3.0x3.0mm]
U802  SE2435L  [vqfn24_4x4mm RF]
U803  SAW Filter  value B3717  [DCC6C_3.0x3.0mm]
U805  SAW Filter  value B3717  [DCC6C_3.0x3.0mm]
U900  SX1257  [vqfn32_5x5mm]
Y800  TCXO  value 32.0MHz  [TCXO 2.0x1.6mm]

### Nets
GND: C800.1 C802.2 C803.1 C804.2 C805.2 C806.1 C807.1 C808.1 C814.2 C815.1 C818.1 C819.1 C820.1 C821.1 C822.1 C823.1 C825.1 C826.1 C827.1 C828.2 C831.1 C832.2 C900.1 C903.1 C904.2 C905.2 C906.1 C907.1 C908.1 D801.2(K) L800.1 R801.2 R802.2 R807.1 R809.1 RFIO.2(GND) U800.4(GND) U800.7(GND) U800.26(GND) U800.28(GND) U800.31(GND) U800.33(GND) U801.1(GND) U801.3(GND) U801.4(GND) U801.6(GND) U802.7(ANT_SEL) U802.8(GND) U802.10(NC) U802.13(NC) U802.15(NC) U802.17(NC) U802.18(NC) U802.25(GND) U803.1(GND) U803.3(GND) U803.4(GND) U803.6(GND) U805.1(GND) U805.3(GND) U805.4(GND) U805.6(GND) U900.4(GND) U900.7(GND) U900.12(Q_IN) U900.13(I_IN) U900.26(GND) U900.28(GND) U900.31(GND) U900.33(GND) Y800.1(GND) Y800.2(GND)
VCC_FEM: C820.2 C822.2 C823.2 FB802.2 L804.2 L805.2
VCC_FEM_1: FB802.1
VCCA_A: C800.2 C806.2 C808.2 C818.2 FB801.1 L803.2 U800.2(VBAT1) U800.16(VBAT2) U800.32(VBAT3)
VCCA_B: C900.2 C906.2 C908.2 U900.2(VBAT1) U900.16(VBAT2) U900.32(VBAT3)
CLKI: U800.11(CLK_IN)
CLKO_B: U900.10(CLK_OUT)
FEM_EN: U802.1(CSD)
IRXD_A: U800.15(I_OUT)
IRXD_B: U900.15(I_OUT)
ITXD_A: U800.13(I_IN)
LNA_EN: U802.3(CPS)
MISO_A: U800.18(MISO)
MISO_B: U900.18(MISO)
MOSI_A: U800.19(MOSI)
MOSI_B: U900.19(MOSI)
NSS_A: U800.20(NSS)
NSS_B: U900.20(NSS)
PA_EN: U802.4(CTX)
QRXD_A: U800.14(Q_OUT)
QRXD_B: U900.14(Q_OUT)
QTXD_A: U800.12(Q_IN)
RADIO_RST: D800.2(A) D900.2(A)
SCK_A: U800.17(SCK)
SCK_B: U900.17(SCK)
XTL_OUT: C801.1 C901.2 Y800.3(OUT)
NetC801_2: C801.2 U800.8(XTB)
NetC802_1: C802.1 U800.29(RF_ON)
NetC803_2: C803.2 U800.3(VR_ANA1)
NetC804_1: C804.1 U800.5(VR_DIG)
NetC805_1: C805.1 U800.1(VR_PA)
NetC807_2: C807.2 U800.25(VR_ANA2)
NetC813_1: C813.1 L801.2
NetC813_2: C813.2 C814.1 U801.5(OUT)
NetC815_2: C815.2 FB801.2 Y800.4(VCC)
NetC816_1: C816.1 U800.30(RF_OP)
NetC816_2: C816.2 U805.2(IN)
NetC817_1: C817.1 R808.2 R809.2
NetC817_2: C817.2 U802.2(PA_IN)
NetC819_2: C819.2 L803.1 U802.23(VCC0)
NetC821_2: C821.2 L804.1 U802.24(VCC1)
NetC824_1: C824.1 U801.2(IN)
NetC824_2: C824.2 U802.6(TR)
NetC825_2: C825.2 C826.2 L808.2 L809.1
NetC827_2: C827.2 L809.2 U802.16(TX_IN)
NetC828_1: C828.1 C829.1 D801.1(A) L802.2
NetC829_2: C829.2 RFIO.1(Signal)
NetC830_1: C830.1 C832.1 L802.1 L807.2
NetC830_2: C830.2 C831.2 L807.1 U802.14(ANT1)
NetC901_1: C901.1 U900.8(XTB)
NetC903_2: C903.2 U900.3(VR_ANA1)
NetC904_1: C904.1 U900.5(VR_DIG)
NetC905_1: C905.1 U900.1(VR_PA)
NetC907_2: C907.2 U900.25(VR_ANA2)
NetD800_1: D800.1(K) U800.9(RESET)
NetD900_1: D900.1(K) U900.9(RESET)
NetL800_2: L800.2 L801.1 U800.27(RF_IN) U900.27(RF_IN)
NetL805_1: L805.1 U802.21(VCC2)
NetL808_1: L808.1 U802.20(PA_OUT)
NetR801_1: R801.1 U802.12(ANT2)
NetR802_1: R802.1 U802.5(TX_FLT)
NetR807_2: R807.2 R808.1 U805.5(OUT)
NetU802_9: U802.9(LNA_IN) U803.5(OUT)
NetU802_11: U802.11(RX_FLT) U803.2(IN)

Not connected (* = marked no-connect by the designer): U800 6(XTA)* 10(CLK_OUT)* 21(DIO0)* 22(DIO1)* 23(DIO2)* 24(DIO3)*; U802 19(NC)* 22(NC)*; U900 6(XTA)* 11(CLK_IN)* 21(DIO0)* 22(DIO1)* 23(DIO2)* 24(DIO3)* 29(RF_ON)* 30(RF_OP)*

### Notes on the sheet
- SX1308 Picocell Gateway - RF Part:
- TCXO 32.0MHz
- SX1308 Picocell Gateway - RF part
- PCB_E381V02C
- V1a

### Library data of the parts
C800-C808 C813-C832 C900 C901 C903-C908 = Cap: Capacitor SMD; Published: 8-Jun-2000; LatestRevisionDate: 05-oct-2007  -  Semtech; LatestRevisionNote: Re-released for DXP Platform.; Publisher: Altium Limited
D800 D900 = D Schottky: Schottky Diode; Published: 8-Jun-2000; LatestRevisionDate: 17-Jul-2002; LatestRevisionNote: Re-released for DXP Platform.; PackageReference: SMB; Publisher: Altium Limited
D801 = RClamp0531T: as D201 on sheet SX1308_GTW_e381v02c_Power; LatestRevisionDate: 23-Aug-2016
FB801 FB802 = Ferrite beads: Value: VAL?
L800-L805 L807-L809 = Inductor: Code_IEC: 1005; Published: 8-Jun-2000; LatestRevisionDate: 05-oct-2007  -  Semtech; LatestRevisionNote: Re-released for DXP Platform.; Publisher: Altium Limited; Code_JEITA: 0402
R801 R802 R807-R809 = Resistor: Resistor SMD - IEC symbol version; LatestRevisionDate: 27-Jul-20  -  Semtech
RFIO = SMA: SMA Straight Connector; LatestRevisionDate: 05-oct-2007  -  Semtech; LatestRevisionNote: Re-released for DXP Platform.; Publisher: Altium Limited
U800 U900 = SX1257: SX1257 RF Front-End Transceiver - I/Q New Pinout; LatestRevisionDate: 06-Dec-2013  -  Semtech
U801 U803 U805 = SAW Filter: SAW Filter - Bandpass - TEMEX type; LatestRevisionDate: 05-oct-2007  -  Semtech
U802 = SE2435L: SE2435L - Skyworks High Power RF Front End Module

## Sheet SX1308_GTW_e381v02c_STM32_MCU.SchDoc
size B; DrawnBy: Erik Fountain; DocumentNumber: 3; SheetNumber: 3; SheetTotal: 5; PageSetup: Record=PageOptions|CenterHorizontal=True|CenterVertical=True|PrintScale=0.72|XCorrection=1.00|YCorrection=1.00|PrintKind=0|BorderSize=5000000|LeftOffset=0|BottomOffset=0|Orientation=2|PaperLength=1000|PaperWidth=1000|Scale=100|PaperSource=7|PrintQuality=-4|MediaType=1|DitherType=10|PaperKind=Letter|PrintScaleMode=1
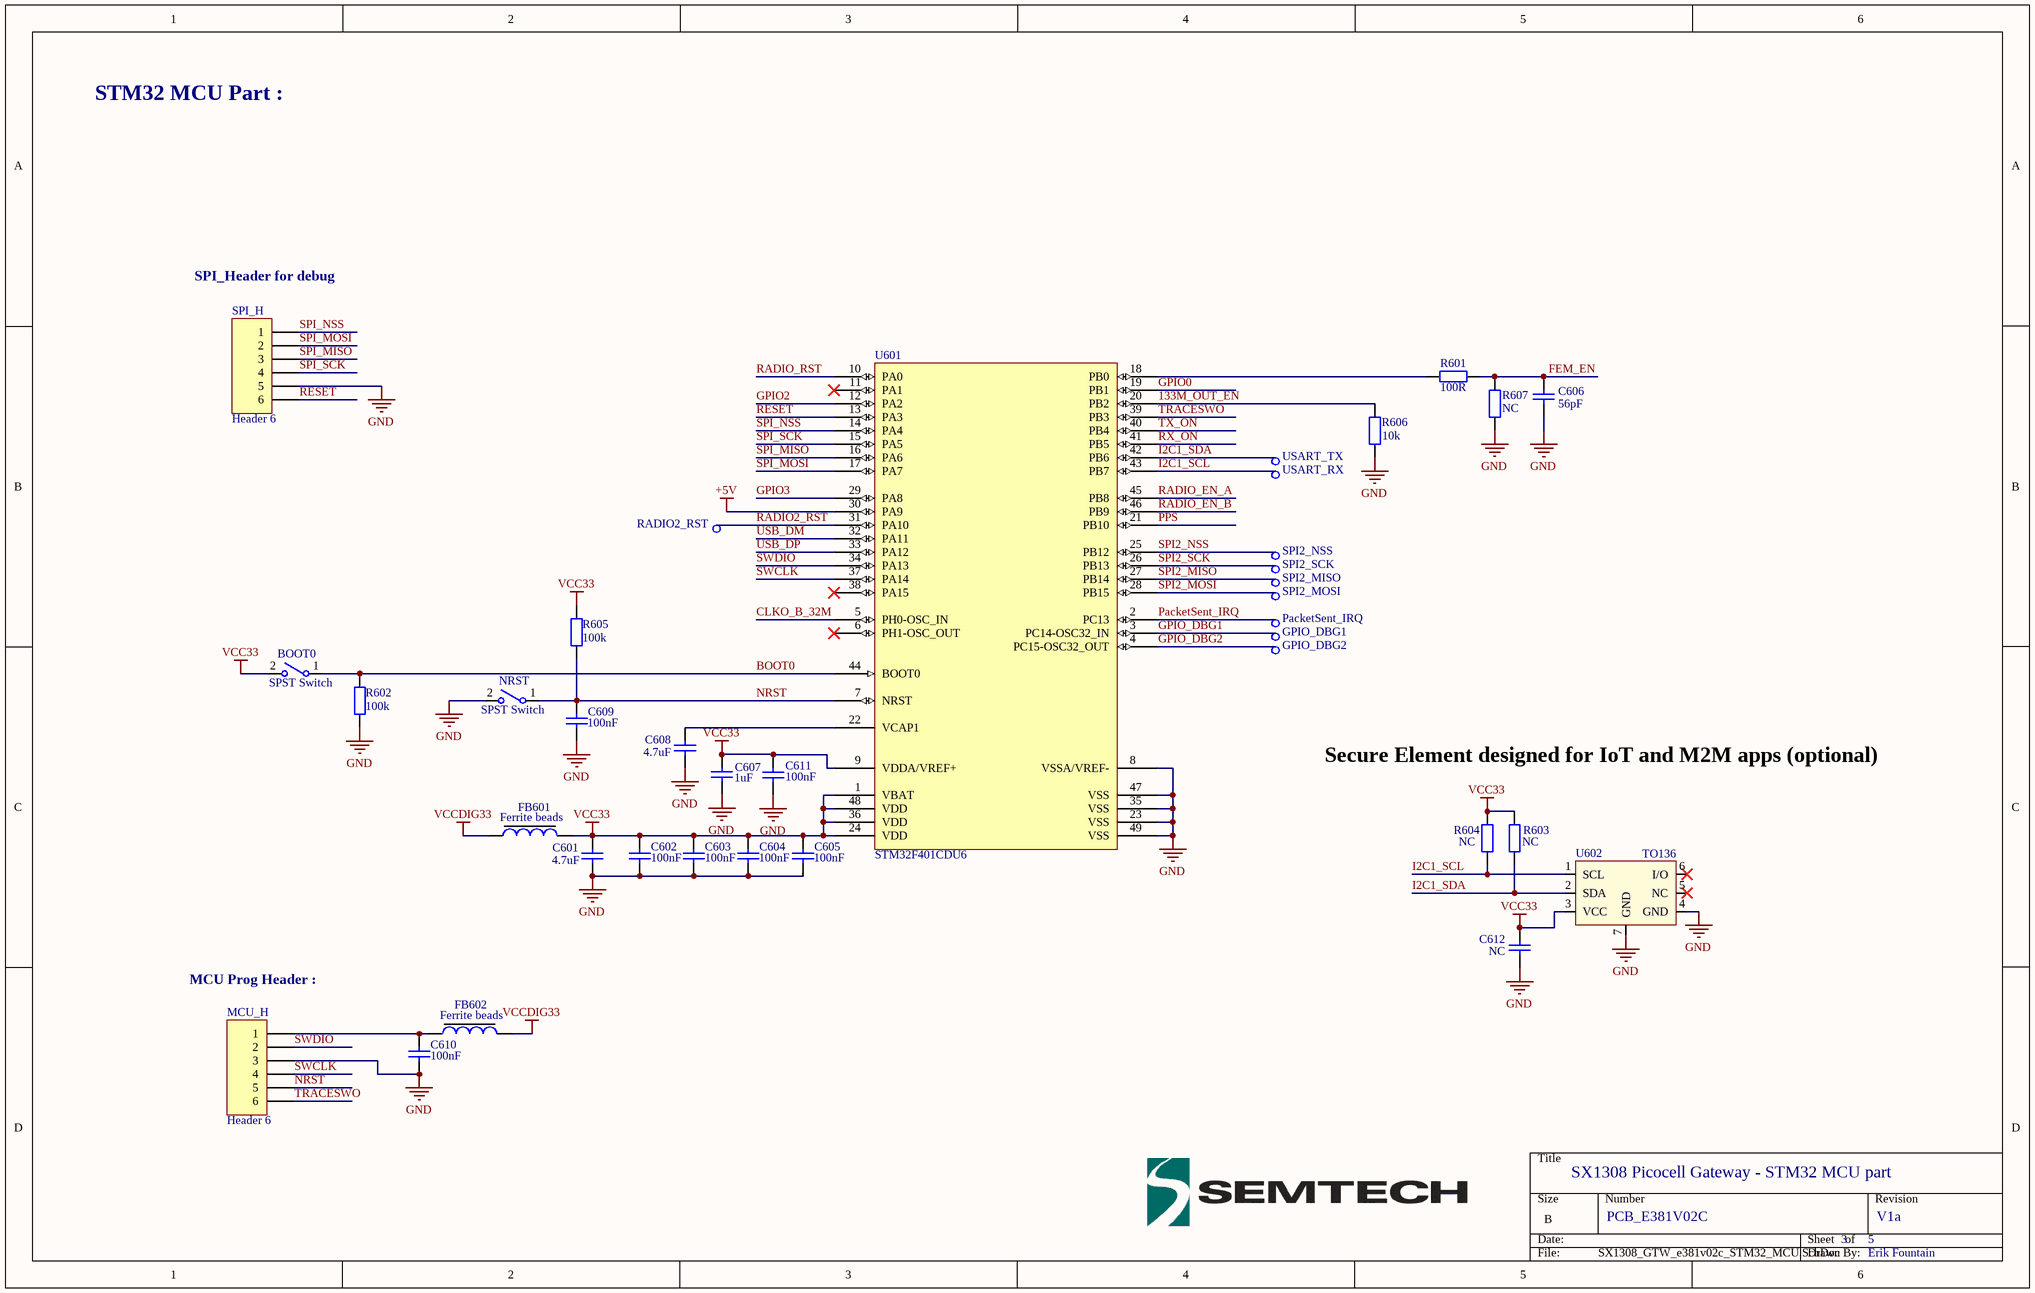
[diagram p5: SX1308_GTW_e381v02c_STM32_MCU.SchDoc]

### Parts
BOOT0  SPST Switch  [KXT_series_switch_3.5x2.0mm]
C601  value 4.7uF  [rlc_603_smd]  (hidden comment: Cap)
C602  value 100nF  [rlc_402_smd]  (hidden comment: Cap)
C603  value 100nF  [rlc_402_smd]  (hidden comment: Cap)
C604  value 100nF  [rlc_402_smd]  (hidden comment: Cap)
C605  value 100nF  [rlc_402_smd]  (hidden comment: Cap)
C606  value 56pF  [rlc_402_smd]  (hidden comment: Cap)
C607  value 1uF  [rlc_402_smd]  (hidden comment: Cap)
C608  value 4.7uF  [rlc_603_smd]  (hidden comment: Cap)
C609  value 100nF  [rlc_402_smd]  (hidden comment: Cap)
C610  value 100nF  [rlc_402_smd]  (hidden comment: Cap)
C611  value 100nF  [rlc_402_smd]  (hidden comment: Cap)
C612  value NC  [rlc_402_smd]  (hidden comment: Cap)
FB601  Ferrite beads  [rlc_402_smd]
FB602  Ferrite beads  [rlc_402_smd]
GPIO_DBG1  Test Pin  [PIN_SMD]  (value not drawn)
GPIO_DBG2  Test Pin  [PIN_SMD]  (value not drawn)
MCU_H  Header 6  [HDR1X6_SMD]
NRST  SPST Switch  [KXT_series_switch_3.5x2.0mm]
PacketSent_IRQ  Test Pin  [PIN_SMD]  (value not drawn)
R601  value 100R  [rlc_402_smd]  (hidden comment: Resistor)
R602  value 100k  [rlc_402_smd]  (hidden comment: Resistor)
R603  value NC  [rlc_201_smd]  (hidden comment: Resistor)
R604  value NC  [rlc_201_smd]  (hidden comment: Resistor)
R605  value 100k  [rlc_402_smd]  (hidden comment: Resistor)
R606  value 10k  [rlc_402_smd]  (hidden comment: Resistor)
R607  value NC  [rlc_402_smd]  (hidden comment: Resistor)
RADIO2_RST  Test Pin  [PIN_SMD]  (value not drawn)
SPI2_MISO  Test Pin  [PIN_SMD]  (value not drawn)
SPI2_MOSI  Test Pin  [PIN_SMD]  (value not drawn)
SPI2_NSS  Test Pin  [PIN_SMD]  (value not drawn)
SPI2_SCK  Test Pin  [PIN_SMD]  (value not drawn)
SPI_H  Header 6  [HDR1X6_SMD]
U601  STM32F401CDU6  [UFQFPN48_7x7MM]
U602  TO136  [DFN6_3X3mm]
USART_RX  Test Pin  [PIN_SMD]  (value not drawn)
USART_TX  Test Pin  [PIN_SMD]  (value not drawn)

### Nets
+5V: U601.30(PA9)
GND: C601.1 C602.1 C603.1 C604.1 C605.1 C606.1 C607.1 C608.1 C609.1 C610.1 C611.1 C612.1 MCU_H.3 NRST.2(NO) R602.1 R606.1 R607.1 SPI_H.5 U601.8(VSSA/VREF-) U601.23(VSS) U601.35(VSS) U601.47(VSS) U601.49(VSS) U602.4(GND) U602.7(GND)
VCC33: BOOT0.2(NO) C601.2 C602.2 C603.2 C604.2 C605.2 C607.2 C611.2 C612.2 FB601.2 R603.2 R604.2 R605.2 U601.1(VBAT) U601.9(VDDA/VREF+) U601.24(VDD) U601.36(VDD) U601.48(VDD) U602.3(VCC)
VCCDIG33: FB601.1 FB602.2
133M_OUT_EN: R606.2 U601.20(PB2)
BOOT0: BOOT0.1(COMMON) R602.2 U601.44(BOOT0)
CLKO_B_32M: U601.5(PH0-OSC_IN)
FEM_EN: C606.2 R601.2 R607.2
GPIO0: U601.19(PB1)
GPIO2: U601.12(PA2)
GPIO3: U601.29(PA8)
GPIO_DBG1: GPIO_DBG1.1(pin) U601.3(PC14-OSC32_IN)
GPIO_DBG2: GPIO_DBG2.1(pin) U601.4(PC15-OSC32_OUT)
I2C1_SCL: R604.1 U601.43(PB7) U602.1(SCL) USART_RX.1(pin)
I2C1_SDA: R603.1 U601.42(PB6) U602.2(SDA) USART_TX.1(pin)
NRST: C609.2 MCU_H.5 NRST.1(COMMON) R605.1 U601.7(NRST)
PacketSent_IRQ: PacketSent_IRQ.1(pin) U601.2(PC13)
PPS: U601.21(PB10)
RADIO2_RST: RADIO2_RST.1(pin) U601.31(PA10)
RADIO_EN_A: U601.45(PB8)
RADIO_EN_B: U601.46(PB9)
RADIO_RST: U601.10(PA0)
RESET: SPI_H.6 U601.13(PA3)
RX_ON: U601.41(PB5)
SPI2_MISO: SPI2_MISO.1(pin) U601.27(PB14)
SPI2_MOSI: SPI2_MOSI.1(pin) U601.28(PB15)
SPI2_NSS: SPI2_NSS.1(pin) U601.25(PB12)
SPI2_SCK: SPI2_SCK.1(pin) U601.26(PB13)
SPI_MISO: SPI_H.3 U601.16(PA6)
SPI_MOSI: SPI_H.2 U601.17(PA7)
SPI_NSS: SPI_H.1 U601.14(PA4)
SPI_SCK: SPI_H.4 U601.15(PA5)
SWCLK: MCU_H.4 U601.37(PA14)
SWDIO: MCU_H.2 U601.34(PA13)
TRACESWO: MCU_H.6 U601.39(PB3)
TX_ON: U601.40(PB4)
USB_DM: U601.32(PA11)
USB_DP: U601.33(PA12)
NetC608_2: C608.2 U601.22(VCAP1)
NetC610_2: C610.2 FB602.1 MCU_H.1
NetR601_1: R601.1 U601.18(PB0)

Not connected (* = marked no-connect by the designer): U601 6(PH1-OSC_OUT)* 11(PA1)* 38(PA15)*; U602 5(NC)* 6(I/O)*

### Notes on the sheet
- STM32 MCU Part :
- (near SPI_H) SPI_Header for debug
- Secure Element designed for IoT and M2M apps (optional)
- (near MCU_H) MCU Prog Header :
- SX1308 Picocell Gateway - STM32 MCU part
- PCB_E381V02C
- V1a

### Library data of the parts
BOOT0 NRST = SW-SPST: SPST, N.O. - Tactile Switch; Value: KXT121LHS; Published: 22-Nov-2016
C601-C612 = Cap: Capacitor SMD; Published: 8-Jun-2000; LatestRevisionDate: 05-oct-2007  -  Semtech; LatestRevisionNote: Re-released for DXP Platform.; Publisher: Altium Limited
FB601 FB602 = Ferrite beads: Value: VAL?
GPIO_DBG1 GPIO_DBG2 PacketSent_IRQ RADIO2_RST SPI2_MISO SPI2_MOSI SPI2_NSS SPI2_SCK USART_RX USART_TX = test_pin: LatestRevisionDate: 05-oct-2007  -  Semtech
MCU_H SPI_H = Header 6: Header, 6-Pin; LatestRevisionDate: 17-Jul-2002; LatestRevisionNote: Re-released for DXP Platform.; Publisher: Altium Limited
R601-R607 = Resistor: Resistor SMD - IEC symbol version; LatestRevisionDate: 27-Jul-20  -  Semtech
U601 = STM32F401CDU6: STM32 ARM Cortex M4 32-bit MCU with 256Kbytes Flash/96kB RAM, UFQFPN48 package; ComponentLink1Description: Manufacturer Link; ComponentLink1URL: www.st.com/stm32
U602 = TO136: TO136 - Secure Element designed for IoT and M2M applications.; LatestRevisionDate: 26-Feb-2016 -  Semtech

## Nets that join several sheets
+5V: SX1308_GTW_e381v02c_Power (18 pins), SX1308_GTW_e381v02c_STM32_MCU (U601.30)
GND: SX1308_GTW_e381v02c_Top (6 pins), SX1308_GTW_e381v02c_Power (31 pins), SX1308_GTW_e381v02c_SX1308_part (44 pins), SX1308_GTW_e381v02c_RF_Part (72 pins), SX1308_GTW_e381v02c_STM32_MCU (25 pins)
VCC_FEM_1: SX1308_GTW_e381v02c_Power (C206.1 R202.1 U203.6), SX1308_GTW_e381v02c_RF_Part (FB802.1)
VCCA_A: SX1308_GTW_e381v02c_Power (C210.1 U202.3), SX1308_GTW_e381v02c_RF_Part (9 pins)
VCCA_B: SX1308_GTW_e381v02c_Power (C211.1 U202.1), SX1308_GTW_e381v02c_RF_Part (6 pins)
VCCDIG18_1: SX1308_GTW_e381v02c_Power (C203.1 L201.2 U201.9), SX1308_GTW_e381v02c_SX1308_part (C101.2 FB101.1)
VCCDIG33: SX1308_GTW_e381v02c_Power (C202.1 FB204.1 L200.1 U201.18), SX1308_GTW_e381v02c_SX1308_part (7 pins), SX1308_GTW_e381v02c_STM32_MCU (FB601.1 FB602.2)
133M_OUT_EN: SX1308_GTW_e381v02c_SX1308_part (Y100.1), SX1308_GTW_e381v02c_STM32_MCU (R606.2 U601.20)
CLKI: SX1308_GTW_e381v02c_SX1308_part (R113.2), SX1308_GTW_e381v02c_RF_Part (U800.11)
CLKO_B: SX1308_GTW_e381v02c_SX1308_part (R111.2 R112.2), SX1308_GTW_e381v02c_RF_Part (U900.10)
CLKO_B_32M: SX1308_GTW_e381v02c_SX1308_part (R112.1), SX1308_GTW_e381v02c_STM32_MCU (U601.5)
FEM_EN: SX1308_GTW_e381v02c_Power (U203.2), SX1308_GTW_e381v02c_RF_Part (U802.1), SX1308_GTW_e381v02c_STM32_MCU (C606.2 R601.2 R607.2)
GPIO0: SX1308_GTW_e381v02c_SX1308_part (U100.58), SX1308_GTW_e381v02c_STM32_MCU (U601.19)
GPIO2: SX1308_GTW_e381v02c_SX1308_part (U100.56), SX1308_GTW_e381v02c_STM32_MCU (U601.12)
GPIO3: SX1308_GTW_e381v02c_SX1308_part (U100.55), SX1308_GTW_e381v02c_STM32_MCU (U601.29)
IRXD_A: SX1308_GTW_e381v02c_SX1308_part (R100_A.5), SX1308_GTW_e381v02c_RF_Part (U800.15)
IRXD_B: SX1308_GTW_e381v02c_SX1308_part (R101_B.5), SX1308_GTW_e381v02c_RF_Part (U900.15)
ITXD_A: SX1308_GTW_e381v02c_SX1308_part (R100_A.7), SX1308_GTW_e381v02c_RF_Part (U800.13)
LNA_EN: SX1308_GTW_e381v02c_SX1308_part (C102.2 R103.2 R115.1), SX1308_GTW_e381v02c_RF_Part (U802.3)
MISO_A: SX1308_GTW_e381v02c_SX1308_part (U100.62), SX1308_GTW_e381v02c_RF_Part (U800.18)
MISO_B: SX1308_GTW_e381v02c_SX1308_part (U100.21), SX1308_GTW_e381v02c_RF_Part (U900.18)
MOSI_A: SX1308_GTW_e381v02c_SX1308_part (U100.63), SX1308_GTW_e381v02c_RF_Part (U800.19)
MOSI_B: SX1308_GTW_e381v02c_SX1308_part (U100.20), SX1308_GTW_e381v02c_RF_Part (U900.19)
NSS_A: SX1308_GTW_e381v02c_SX1308_part (U100.64), SX1308_GTW_e381v02c_RF_Part (U800.20)
NSS_B: SX1308_GTW_e381v02c_SX1308_part (U100.19), SX1308_GTW_e381v02c_RF_Part (U900.20)
PA_EN: SX1308_GTW_e381v02c_SX1308_part (C114.2 R108.2 R114.1), SX1308_GTW_e381v02c_RF_Part (U802.4)
PPS: SX1308_GTW_e381v02c_SX1308_part (U100.9), SX1308_GTW_e381v02c_STM32_MCU (U601.21)
QRXD_A: SX1308_GTW_e381v02c_SX1308_part (R100_A.6), SX1308_GTW_e381v02c_RF_Part (U800.14)
QRXD_B: SX1308_GTW_e381v02c_SX1308_part (R101_B.6), SX1308_GTW_e381v02c_RF_Part (U900.14)
QTXD_A: SX1308_GTW_e381v02c_SX1308_part (R100_A.8), SX1308_GTW_e381v02c_RF_Part (U800.12)
RADIO_EN_A: SX1308_GTW_e381v02c_Power (R204.2 U202.6), SX1308_GTW_e381v02c_STM32_MCU (U601.45)
RADIO_EN_B: SX1308_GTW_e381v02c_Power (R205.2 U202.4), SX1308_GTW_e381v02c_STM32_MCU (U601.46)
RADIO_RST: SX1308_GTW_e381v02c_RF_Part (D800.2 D900.2), SX1308_GTW_e381v02c_STM32_MCU (U601.10)
RESET: SX1308_GTW_e381v02c_SX1308_part (R110.2 U100.1), SX1308_GTW_e381v02c_STM32_MCU (SPI_H.6 U601.13)
RX_ON: SX1308_GTW_e381v02c_SX1308_part (R105.2 U100.57), SX1308_GTW_e381v02c_STM32_MCU (U601.41)
SCK_A: SX1308_GTW_e381v02c_SX1308_part (U100.61), SX1308_GTW_e381v02c_RF_Part (U800.17)
SCK_B: SX1308_GTW_e381v02c_SX1308_part (U100.22), SX1308_GTW_e381v02c_RF_Part (U900.17)
SPI_MISO: SX1308_GTW_e381v02c_SX1308_part (U100.3), SX1308_GTW_e381v02c_STM32_MCU (SPI_H.3 U601.16)
SPI_MOSI: SX1308_GTW_e381v02c_SX1308_part (U100.4), SX1308_GTW_e381v02c_STM32_MCU (SPI_H.2 U601.17)
SPI_NSS: SX1308_GTW_e381v02c_SX1308_part (U100.5), SX1308_GTW_e381v02c_STM32_MCU (SPI_H.1 U601.14)
SPI_SCK: SX1308_GTW_e381v02c_SX1308_part (U100.2), SX1308_GTW_e381v02c_STM32_MCU (SPI_H.4 U601.15)
TX_ON: SX1308_GTW_e381v02c_SX1308_part (R106.2 U100.54), SX1308_GTW_e381v02c_STM32_MCU (U601.40)
USB_DM: SX1308_GTW_e381v02c_Power (R206.2), SX1308_GTW_e381v02c_STM32_MCU (U601.32)
USB_DP: SX1308_GTW_e381v02c_Power (R207.2), SX1308_GTW_e381v02c_STM32_MCU (U601.33)